# EasyEDA schematic SCH_CLAP-SWITCH_2025-06-27.json
TITLE: Sheet_1; REV: 1.0; Date: 2025-06-24; Sheet: 1/1; Drawn By: GOD_SLAYER; Company: Your Company
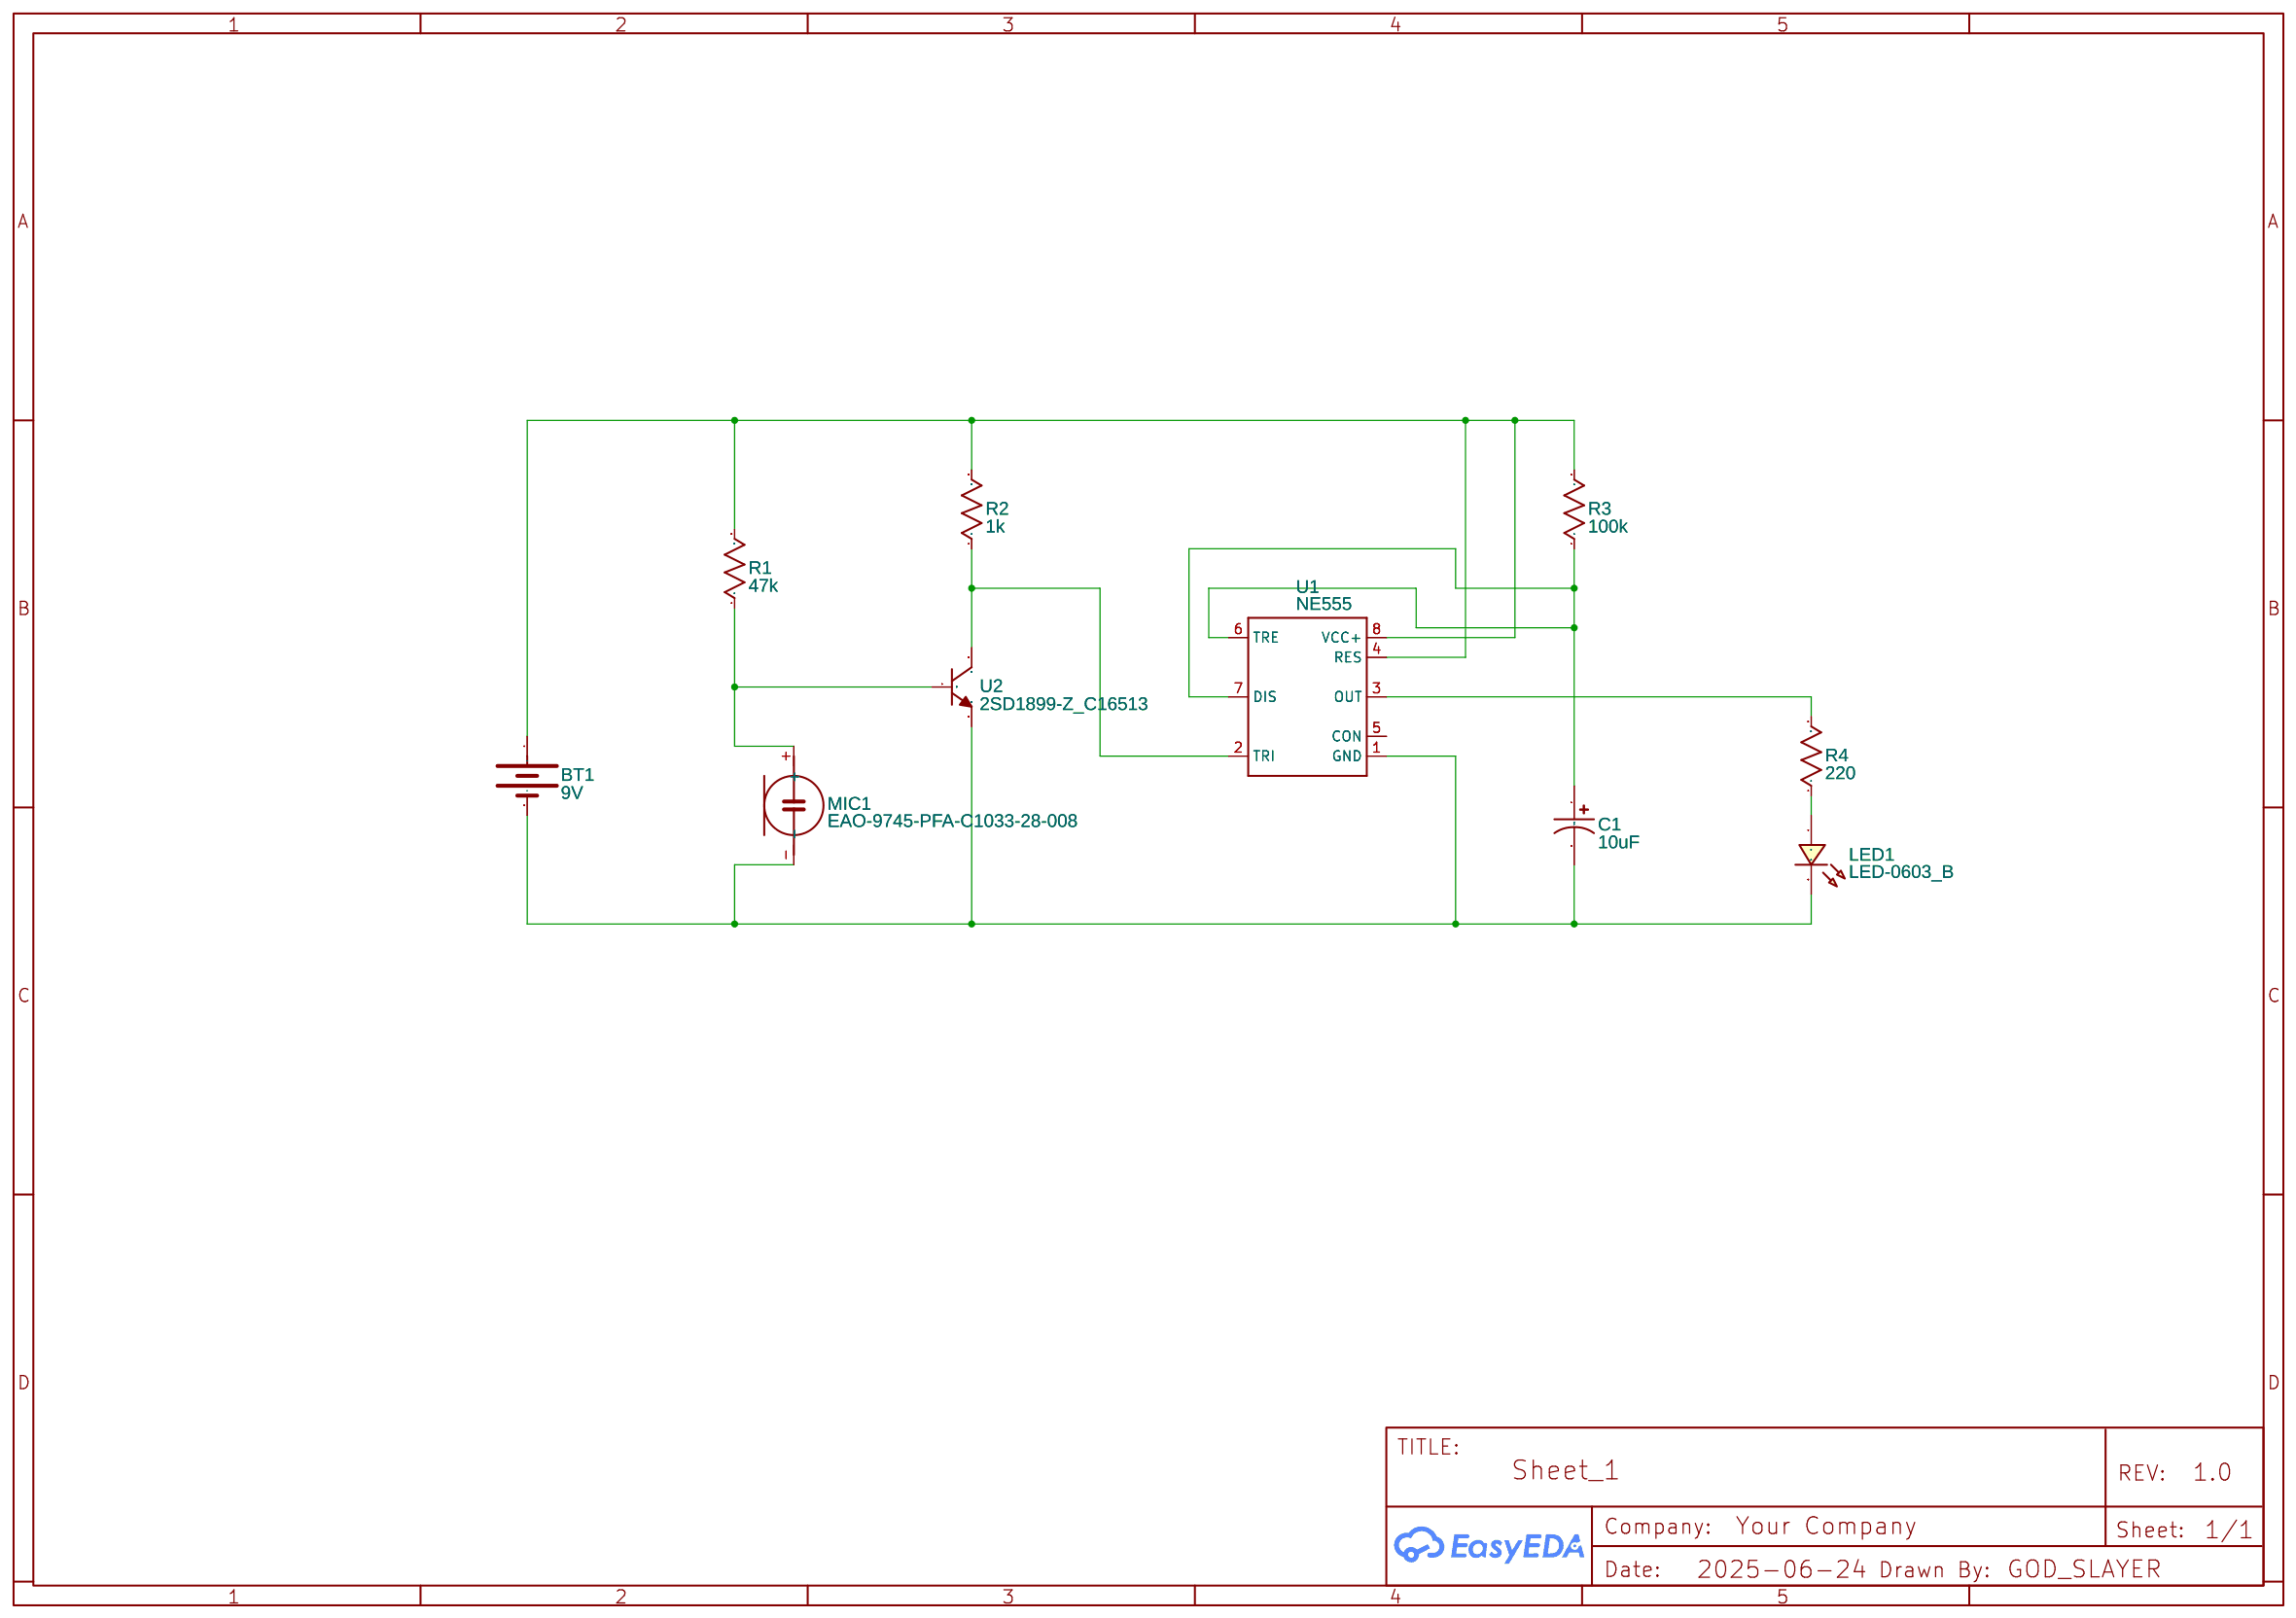
[diagram p0: schematic sheet]

## Parts
BT1  9V  [BAT-TH_2P-9VBATTERY]
C1  10uF  [CAPPR5-5X11]
LED1  LED-0603_B  [LED-SEG-TH_2P-L10.0-W10.0-LED1010]
MIC1  EAO-9745-PFA-C1033-28-008  [MIC2-D9.7XH4.5MM]
R1  47k  [R_AXIAL-0.3]
R2  1k  [R_AXIAL-0.3]
R3  100k  [R_AXIAL-0.3]
R4  220  [R_AXIAL-0.3]
U1  NE555  [DIP08-KIT]
U2  2SD1899-Z_C16513  [TO-251_L6.5-W2.3-P2.30-L]

## Library data of the parts
BT1 = 9V电池铜线扣 铜100MM: Supplier: LCSC; Supplier Part: C70374; Manufacturer: Q&J; Manufacturer Part: 9V电池铜线扣 铜100mm; JLCPCB Part Class: Extended Part; Contributor: lcsc
C1 = CE_SMD_D4.0×H5.5_US: Contributor: LCEDA_Lib
LED1 = LED-0603_B: Manufacturer: EVERLIGHT(台湾亿光); Manufacturer Part: 19-217/BHC-ZL1M2RY/3T; Supplier Part: C72041; Supplier: LCSC; Contributor: LCEDA_01
MIC1 = EAO-9745-PFA-C1033-28-008: Mini Microphone
R1-R4 = R_AXIAL-0.3_US: Contributor: LCEDA_Lib
U1 = NE555: Contributor: SparkFun
U2 = 2SD1899-Z_C16513: Contributor: LCSC; Supplier: LCSC; Manufacturer: CJ; Manufacturer Part: 2SD1899-Z; Supplier Part: C16513

## Nets
Net-(BT1-1): BT1.1(+) R1.2 R2.2 R3.2 U1.4(RES) U1.8(VCC+)
Net-(BT1-2): BT1.2(-) C1.2 LED1.2 MIC1.- U1.1(GND) U2.3(E)
Net-(C1-1): C1.1 R3.1 U1.6(TRE) U1.7(DIS)
Net-(LED1-1): LED1.1 R4.1
Net-(MIC1-+): MIC1.+ R1.1 U2.1(B)
Net-(R2-1): R2.1 U1.2(TRI) U2.2(C)
Net-(R4-2): R4.2 U1.3(OUT)

Not connected (* = marked no-connect by the designer): U1 5(CON)
